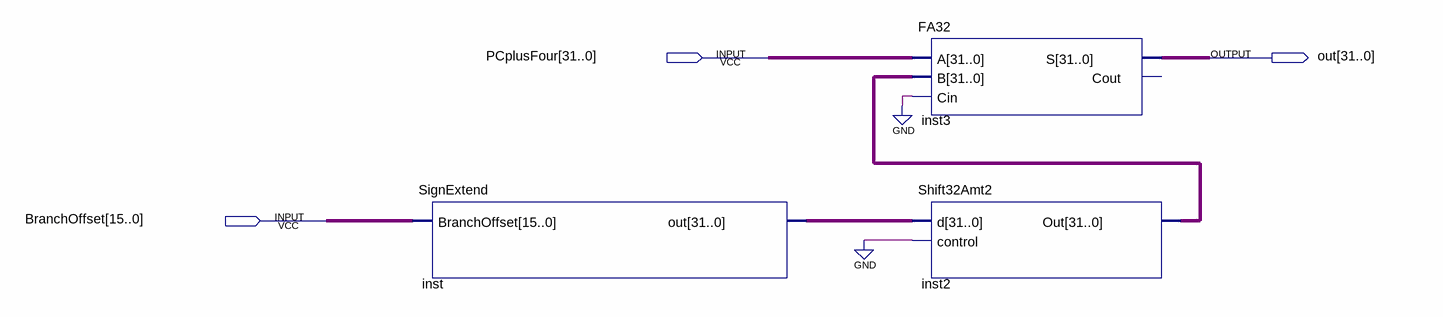
[diagram p0: schematic sheet]
// Quartus schematic Branch.bdf as structural Verilog: 3 symbols, 3 pins
module Branch (
  input  [31:0] PCplusFour,
  input  [15:0] BranchOffset,
  output [31:0] out
);

  wire [31:0] inst2_out, inst_out;

  SignExtend inst (.BranchOffset(BranchOffset), .out(inst_out));
  FA32 inst3 (.A(PCplusFour), .B(inst2_out), .Cin(1'b0), .S(out));  // open: Cout
  Shift32Amt2 inst2 (.d(inst_out), .control(1'b0), .Out(inst2_out));
endmodule
